# EAGLE board csa_drvio_v1.1a (EAGLE 6.4)
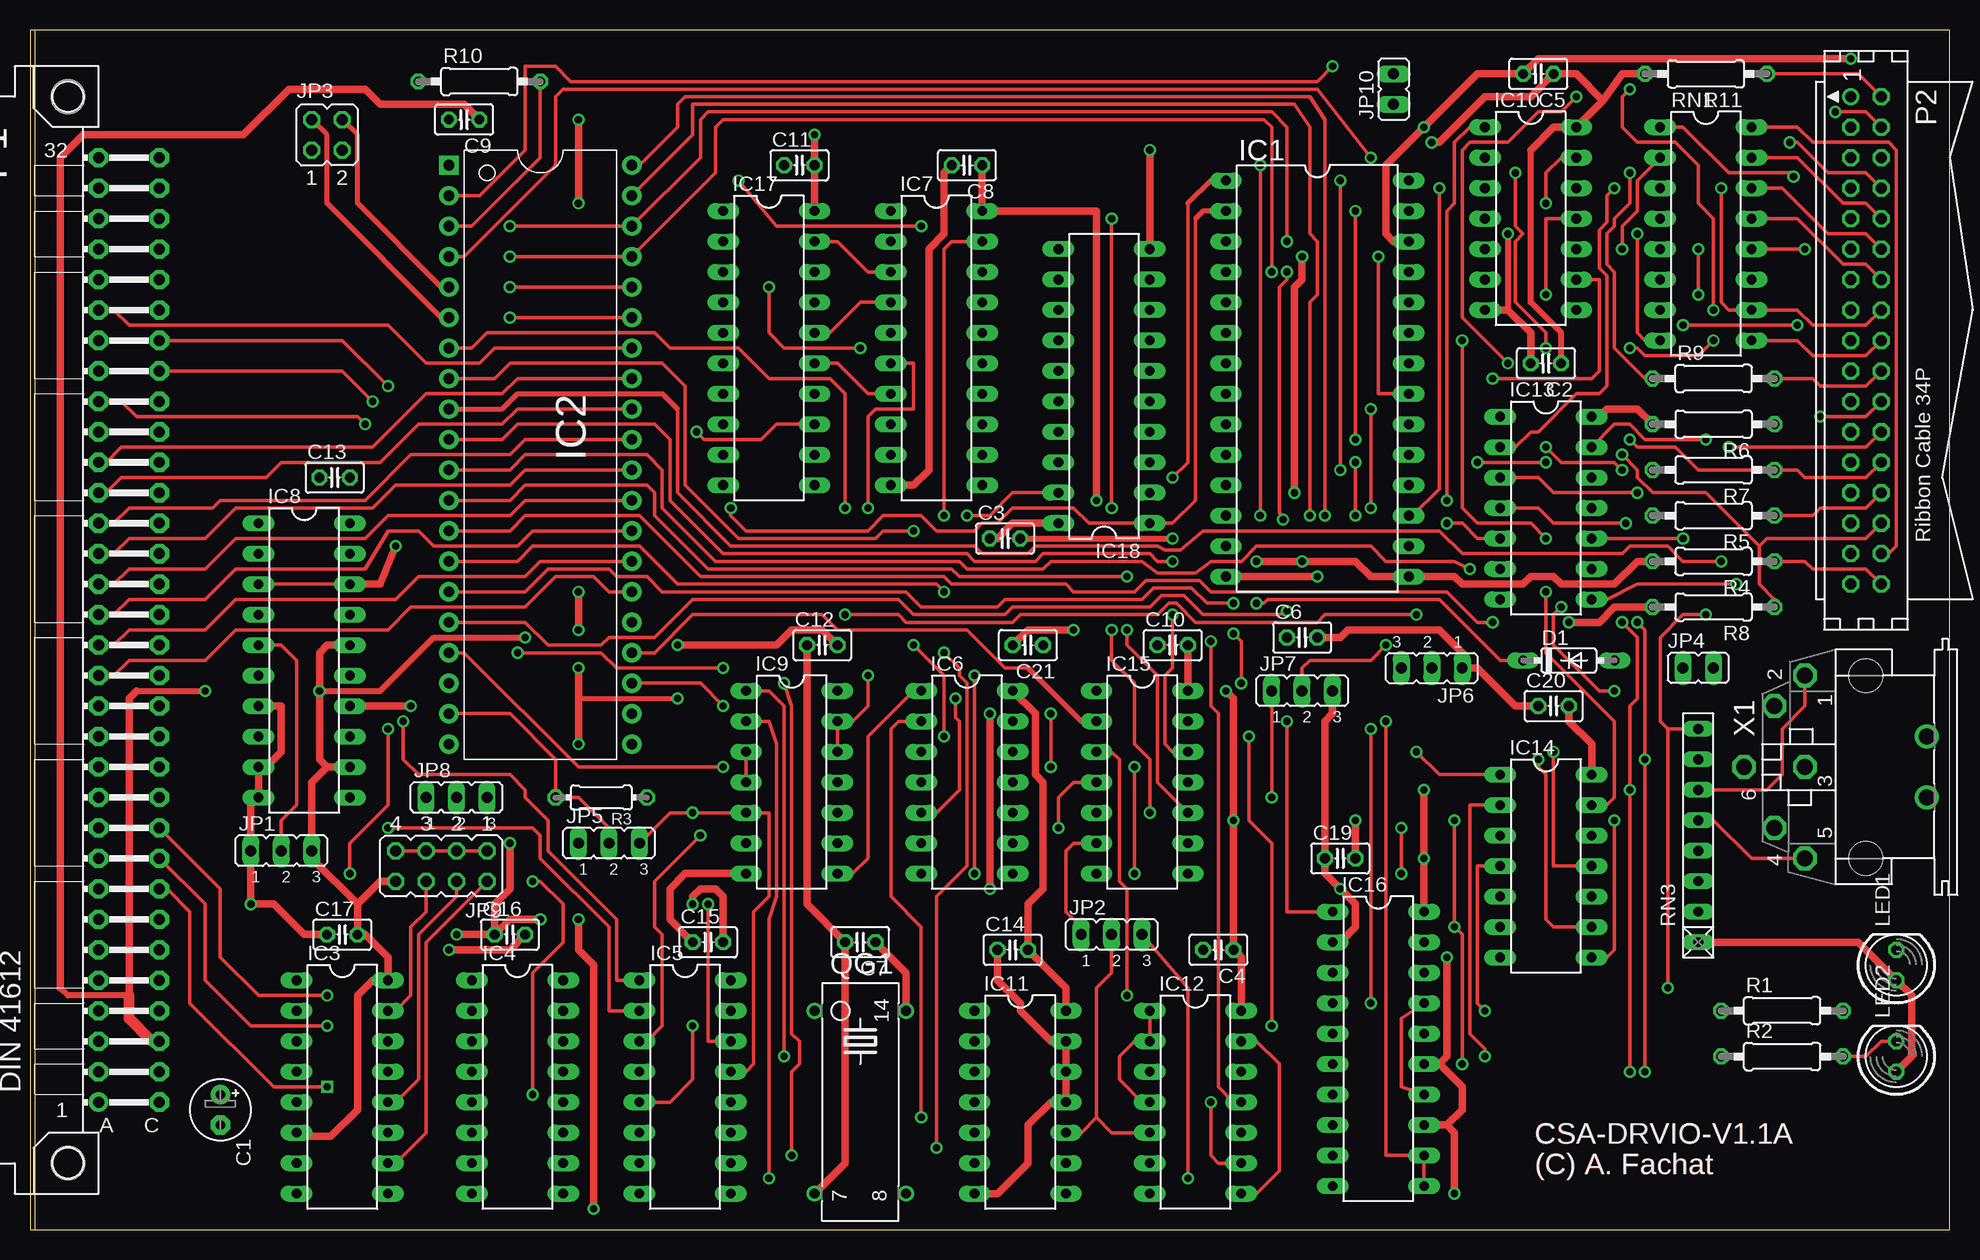
[diagram p2: board, top side]
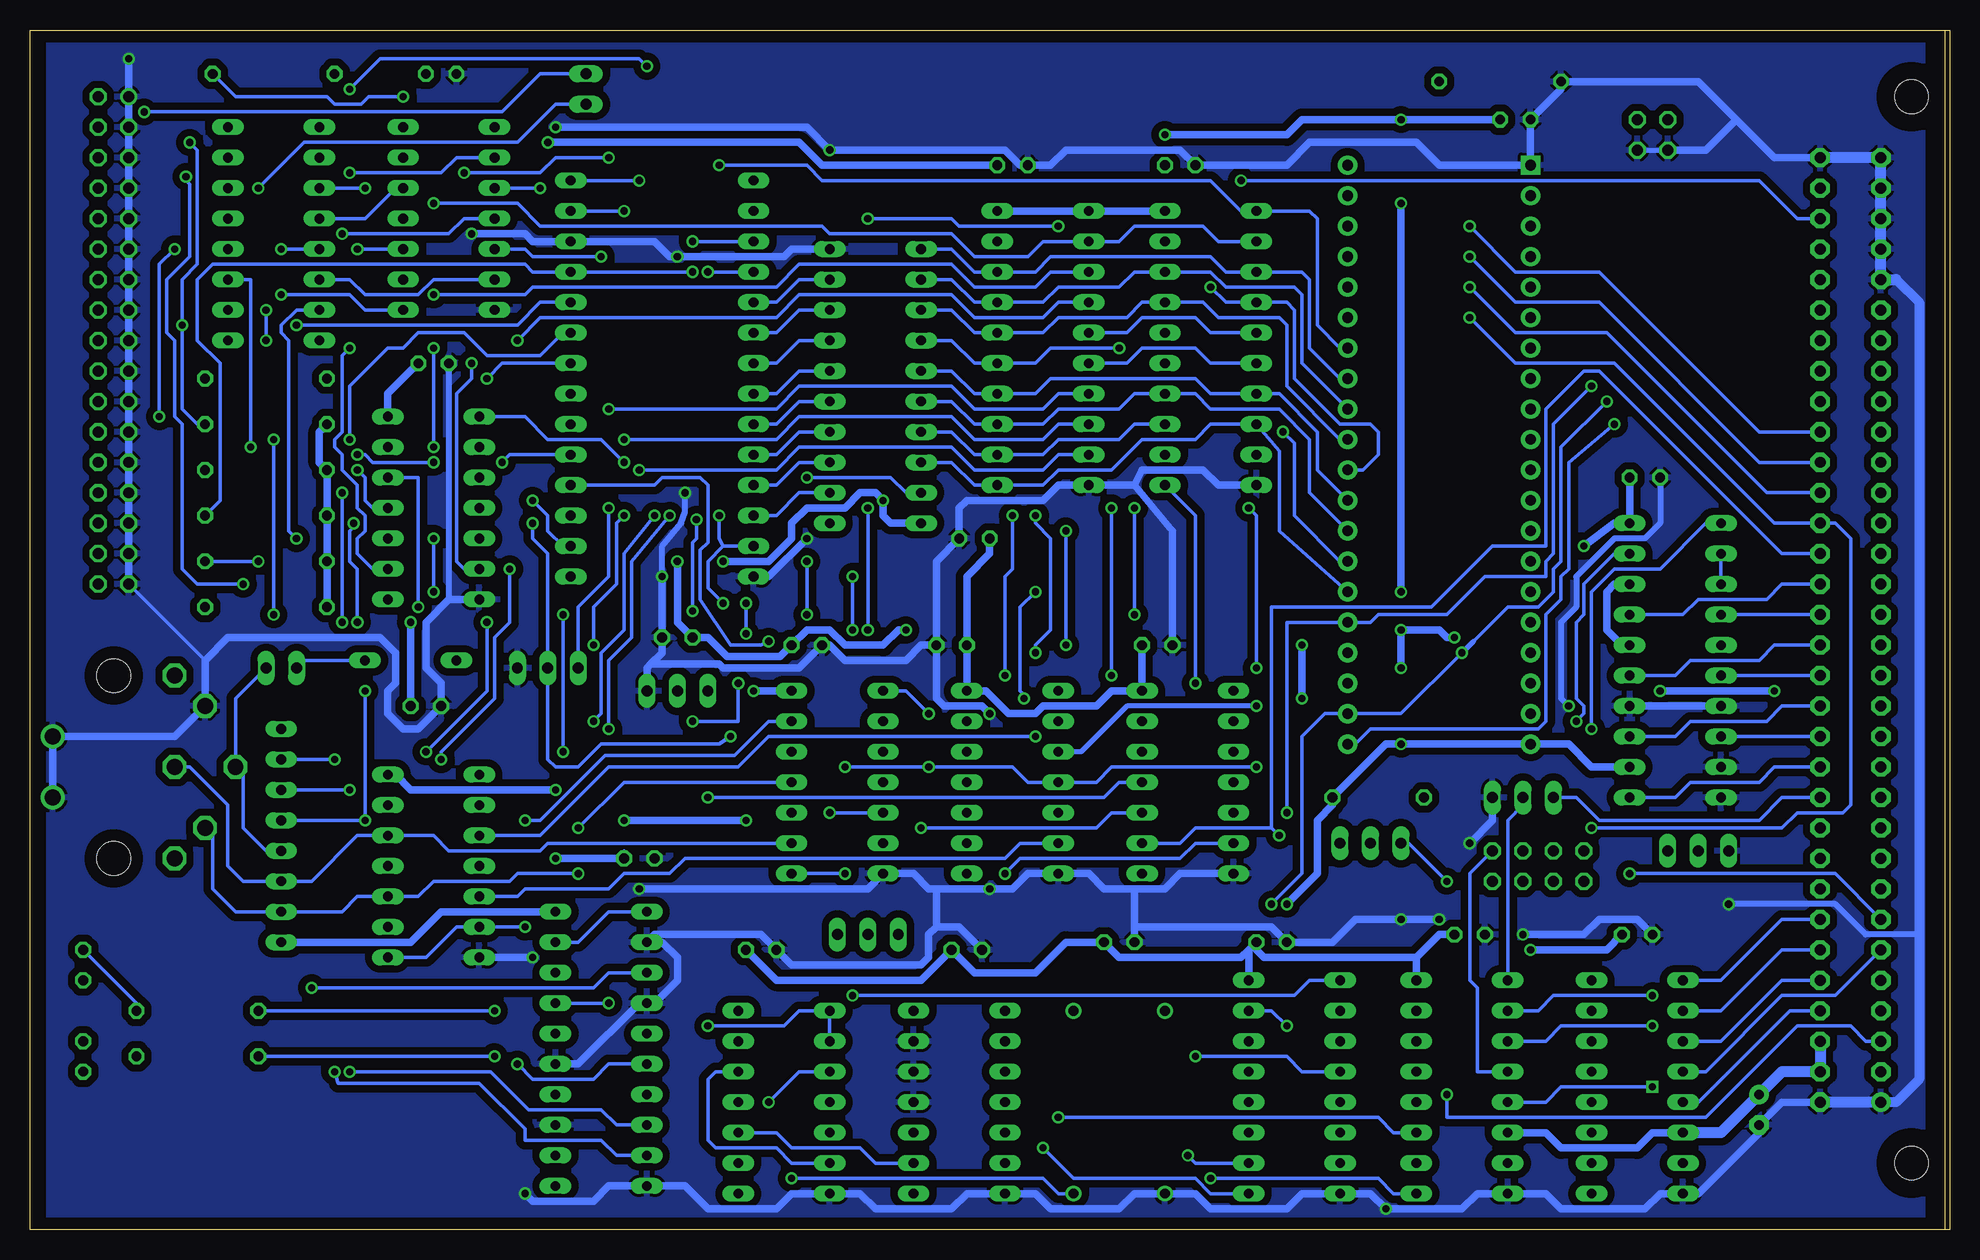
[diagram p3: board, bottom side, seen from below]

Size 160 x 100.03 mm. Coordinates in mm from the lower left corner, seen from the top.
Outline: 0,0.01 160,0.01 160,100.01 0,100.01 0,0.01
Copper layers (1*16): Top 0.035mm / dielectric 1.5mm / Bottom 0.035mm
Design rules "default *": minimum track width 10mil, minimum drill 12mil, track to track 8mil, track to pad 8mil, pad to pad 8mil, via to via 8mil, smd to smd 8mil, copper to edge 40mil, drill to drill 8mil, minimum pad ring 10mil, minimum via ring 8mil, stop-mask expansion 4mil, vias tented up to drill 0mil, thermal gap 10mil

## Footprints (pad centres in the part's own frame; a part is rotated, then mirrored left to right if it is on the bottom)
E2,5-5 = drill 0.813 pad 1.6: + -1.27,0 | drill 0.813 pad 1.6 octagon: - 1.27,0
C025-025X050 = drill 0.813 octagon: 1 -1.27,0; 2 1.27,0
DO35-7 = drill 0.813 long: A 3.81,0; C -3.81,0
DIL28 = drill 0.813 long: 1 -13.97,-7.62; 2 -11.43,-7.62; 3 -8.89,-7.62; 4 -6.35,-7.62; 5 -3.81,-7.62; 6 -1.27,-7.62; 7 1.27,-7.62; 8 3.81,-7.62; 9 6.35,-7.62; 10 8.89,-7.62; 11 11.43,-7.62; 12 13.97,-7.62; 13 16.51,-7.62; 14 19.05,-7.62; 15 19.05,7.62; 16 16.51,7.62; 17 13.97,7.62; 18 11.43,7.62; 19 8.89,7.62; 20 6.35,7.62; 21 3.81,7.62; 22 1.27,7.62; 23 -1.27,7.62; 24 -3.81,7.62; 25 -6.35,7.62; 26 -8.89,7.62; 27 -11.43,7.62; 28 -13.97,7.62
DIP40 = drill 0.889 pad 1.6 square: 1 -24.13,-7.62 | drill 0.889 pad 1.6: 2 -21.59,-7.62; 3 -19.05,-7.62; 4 -16.51,-7.62; 5 -13.97,-7.62; 6 -11.43,-7.62; 7 -8.89,-7.62; 8 -6.35,-7.62; 9 -3.81,-7.62; 10 -1.27,-7.62; 11 1.27,-7.62; 12 3.81,-7.62; 13 6.35,-7.62; 14 8.89,-7.62; 15 11.43,-7.62; 16 13.97,-7.62; 17 16.51,-7.62; 18 19.05,-7.62; 19 21.59,-7.62; 20 24.13,-7.62; 21 24.13,7.62; 22 21.59,7.62; 23 19.05,7.62; 24 16.51,7.62; 25 13.97,7.62; 26 11.43,7.62; 27 8.89,7.62; 28 6.35,7.62; 29 3.81,7.62; 30 1.27,7.62; 31 -1.27,7.62; 32 -3.81,7.62; 33 -6.35,7.62; 34 -8.89,7.62; 35 -11.43,7.62; 36 -13.97,7.62; 37 -16.51,7.62; 38 -19.05,7.62; 39 -21.59,7.62; 40 -24.13,7.62
DIL16 = drill 0.813 long: 1 -8.89,-3.81; 2 -6.35,-3.81; 3 -3.81,-3.81; 4 -1.27,-3.81; 5 1.27,-3.81; 6 3.81,-3.81; 7 6.35,-3.81; 8 8.89,-3.81; 9 8.89,3.81; 10 6.35,3.81; 11 3.81,3.81; 12 1.27,3.81; 13 -1.27,3.81; 14 -3.81,3.81; 15 -6.35,3.81; 16 -8.89,3.81
DIL14 = drill 0.813 long: 1 -7.62,-3.81; 2 -5.08,-3.81; 3 -2.54,-3.81; 4 0,-3.81; 5 2.54,-3.81; 6 5.08,-3.81; 7 7.62,-3.81; 8 7.62,3.81; 9 5.08,3.81; 10 2.54,3.81; 11 0,3.81; 12 -2.54,3.81; 13 -5.08,3.81; 14 -7.62,3.81
DIL20 = drill 0.813 long: 1 -11.43,-3.81; 2 -8.89,-3.81; 3 -6.35,-3.81; 4 -3.81,-3.81; 5 -1.27,-3.81; 6 1.27,-3.81; 7 3.81,-3.81; 8 6.35,-3.81; 9 8.89,-3.81; 10 11.43,-3.81; 11 11.43,3.81; 12 8.89,3.81; 13 6.35,3.81; 14 3.81,3.81; 15 1.27,3.81; 16 -1.27,3.81; 17 -3.81,3.81; 18 -6.35,3.81; 19 -8.89,3.81; 20 -11.43,3.81
DIL20' = drill 0.813 long: 1 -10.16,-3.81; 2 -7.62,-3.81; 3 -5.08,-3.81; 4 -2.54,-3.81; 5 0,-3.81; 6 2.54,-3.81; 7 5.08,-3.81; 8 7.62,-3.81; 9 10.16,-3.81; 10 12.7,-3.81; 11 12.7,3.81; 12 10.16,3.81; 13 7.62,3.81; 14 5.08,3.81; 15 2.54,3.81; 16 0,3.81; 17 -2.54,3.81; 18 -5.08,3.81; 19 -7.62,3.81; 20 -10.16,3.81
JP2 = drill 0.914 long: 1 -2.54,0; 2 0,0; 3 2.54,0
JP2Q = drill 0.914 octagon: 1 -1.27,-1.27; 2 -1.27,1.27; 3 1.27,-1.27; 4 1.27,1.27
JP1 = drill 0.914 long: 1 0,-1.27; 2 0,1.27
JP4Q = drill 0.914 octagon: 1 -3.81,-1.27; 2 -3.81,1.27; 3 -1.27,-1.27; 4 -1.27,1.27; 5 1.27,-1.27; 6 1.27,1.27; 7 3.81,-1.27; 8 3.81,1.27
LED5MM = drill 0.813 octagon: A -1.27,0; K 1.27,0
CSABUS = drill 0.914 pad 1.6: A1 7.62,36.83 | drill 0.914 pad 1.6 octagon: A2 7.62,34.29; A3 7.62,31.75; A4 7.62,29.21; A5 7.62,26.67; A6 7.62,24.13; A7 7.62,21.59; A8 7.62,19.05; A9 7.62,16.51; A10 7.62,13.97; A11 7.62,11.43; A12 7.62,8.89; A13 7.62,6.35; A14 7.62,3.81; A15 7.62,1.27; A16 7.62,-1.27; A17 7.62,-3.81; A18 7.62,-6.35; A19 7.62,-8.89; A20 7.62,-11.43; A21 7.62,-13.97; A22 7.62,-16.51; A23 7.62,-19.05; A24 7.62,-21.59; A25 7.62,-24.13; A26 7.62,-26.67; A27 7.62,-29.21; A28 7.62,-31.75; A29 7.62,-34.29; A30 7.62,-36.83; A31 7.62,-39.37; A32 7.62,-41.91; C1 2.54,36.83; C2 2.54,34.29; C3 2.54,31.75; C4 2.54,29.21; C5 2.54,26.67; C6 2.54,24.13; C7 2.54,21.59; C8 2.54,19.05; C9 2.54,16.51; C10 2.54,13.97; C11 2.54,11.43; C12 2.54,8.89; C13 2.54,6.35; C14 2.54,3.81; C15 2.54,1.27; C16 2.54,-1.27; C17 2.54,-3.81; C18 2.54,-6.35; C19 2.54,-8.89; C20 2.54,-11.43; C21 2.54,-13.97; C22 2.54,-16.51; C23 2.54,-19.05; C24 2.54,-21.59; C25 2.54,-24.13; C26 2.54,-26.67; C27 2.54,-29.21; C28 2.54,-31.75; C29 2.54,-34.29; C30 2.54,-36.83; C31 2.54,-39.37; C32 2.54,-41.91 | hole 2.794: 10.16,41.91; 10.16,-46.99
CON34 = drill 0.914: 1 -19.05,-1.27 | drill 0.914 octagon: 2 -19.05,1.27; 3 -16.51,-1.27; 4 -16.51,1.27; 5 -13.97,-1.27; 6 -13.97,1.27; 7 -11.43,-1.27; 8 -11.43,1.27; 9 -8.89,-1.27; 10 -8.89,1.27; 11 -6.35,-1.27; 12 -6.35,1.27; 13 -3.81,-1.27; 14 -3.81,1.27; 15 -1.27,-1.27; 16 -1.27,1.27; 17 1.27,-1.27; 18 1.27,1.27; 19 3.81,-1.27; 20 3.81,1.27; 21 6.35,-1.27; 22 6.35,1.27; 23 8.89,-1.27; 24 8.89,1.27; 25 11.43,-1.27; 26 11.43,1.27; 27 13.97,-1.27; 28 13.97,1.27; 29 16.51,-1.27; 30 16.51,1.27; 31 19.05,-1.27; 32 19.05,1.27; 33 21.59,-1.27; 34 21.59,1.27
SG51 = drill 0.813: 1 -7.62,-3.81; 7 7.62,-3.81; 8 7.62,3.81; 14 -7.62,3.81
0207/10 = drill 0.813 octagon: 1 -5.08,0; 2 5.08,0
0204/7 = drill 0.813 octagon: 1 -3.81,0; 2 3.81,0
RN-8 = drill 0.813 long: 1 -8.89,0; 2 -6.35,0; 3 -3.81,0; 4 -1.27,0; 5 1.27,0; 6 3.81,0; 7 6.35,0; 8 8.89,0
MAB6H = drill 1.321 octagon: 1 7.62,5.08; 2 5.08,7.62; 3 0,5.08; 4 -5.08,7.62; 5 -7.62,5.08; 6 0,10.16 | drill 1.321: PE -2.54,-5.08; PE@ 2.54,-5.08 | hole 2.794: 7.62,0; -7.62,0

## Placement (x,y rotation side)
C1  47u  [E2,5-5]  15.87,10.01 270 top
C2  [C025-025X050]  126.36,72.24 180 top
C3  [C025-025X050]  81.27,57.63 0 top
C4  [C025-025X050]  99.05,23.34 180 top
C5  [C025-025X050]  125.72,96.37 180 top
C6  [C025-025X050]  106.04,49.38 0 top
C7  [C025-025X050]  69.21,23.98 180 top
C8  [C025-025X050]  78.1,88.75 180 top
C9  [C025-025X050]  36.19,92.56 180 top
C10  [C025-025X050]  95.24,48.74 0 top
C11  [C025-025X050]  64.13,88.75 0 top
C12  [C025-025X050]  66.03,48.74 0 top
C13  [C025-025X050]  25.39,62.71 0 top
C14  [C025-025X050]  81.91,23.34 0 top
C15  [C025-025X050]  56.51,23.98 0 top
C16  [C025-025X050]  40,24.61 0 top
C17  [C025-025X050]  26.03,24.61 0 top
C19  [C025-025X050]  109.21,30.96 0 top
C20  [C025-025X050]  126.99,43.66 0 top
C21  [C025-025X050]  83.18,48.74 180 top
D1  1N4148DO35-7  [DO35-7]  128.27,47.47 0 top
IC1  WD1770  [DIL28]  107.31,73.51 270 top
IC2  CIASMALLPADS  [DIP40]  42.54,64.62 270 top
IC3  74HCT138N  [DIL16]  26.03,11.91 270 top
IC4  74HCT138N  [DIL16]  40.64,11.91 270 top
IC5  74HCT139N  [DIL16]  54.61,11.91 270 top
IC6  74HCT08N  [DIL14]  78.1,37.31 270 top
IC7  74HCT245N  [DIL20]  75.56,73.51 270 top
IC8  74LS688BUSOPT  [DIL20']  22.86,48.74 270 top
IC9  74HCT00N  [DIL14]  63.5,37.31 270 top
IC10  74LS06N  [DIL14]  125.09,84.3 270 top
IC11  74LS293N  [DIL14]  82.55,10.64 270 top
IC12  74HCT00N  [DIL14]  97.15,10.64 270 top
IC13  74LS07N  [DIL14]  126.36,60.17 270 top
IC14  74LS06N  [DIL14]  126.36,30.33 270 top
IC15  74HC14N  [DIL14]  92.7,37.31 270 top
IC16  74HCT241N  [DIL20]  112.39,15.09 270 top
IC17  74LS273BUSOPT  [DIL20']  61.59,74.78 270 top
IC18  74HCT245N  [DIL20]  89.53,70.33 90 top
JP1  [JP2]  20.95,31.6 0 top
JP2  [JP2]  90.16,24.61 0 top
JP3  [JP2Q]  24.76,91.29 0 top
JP4  [JP1]  139.06,46.84 270 top
JP5  [JP2]  48.26,32.23 0 top
JP6  [JP2]  116.83,46.84 180 top
JP7  [JP2]  106.04,44.93 0 top
JP8  [JP2]  35.55,36.04 0 top
JP9  [JP4Q]  34.29,30.33 180 top
JP10  [JP1]  113.66,95.1 0 top
LED1  [LED5MM]  155.57,22.07 90 top
LED2  [LED5MM]  155.57,14.45 90 top
P1  CSABUS  [CSABUS]  13.33,47.47 180 top
P2  SHUGART  [CON34]  153.03,75.41 270 top
QG1  16MHz  [SG51]  69.21,10.64 270 top
R1  150  [0207/10]  146.04,18.26 0 top
R2  620  [0207/10]  146.04,14.45 0 top
R3  4k7  [0204/7]  47.62,36.04 180 top
R4  1k  [0207/10]  140.33,55.73 180 top
R5  1k  [0207/10]  140.33,59.54 180 top
R6  1k  [0207/10]  140.33,67.16 180 top
R7  1k  [0207/10]  140.33,63.35 180 top
R8  220  [0207/10]  140.33,51.92 180 top
R9  47  [0207/10]  140.33,70.97 0 top
R10  4k7  [0207/10]  37.46,95.73 0 top
R11  4k7  [0207/10]  139.69,96.37 180 top
RN1  47  [DIL16]  139.69,83.03 270 top
RN3  10k  [RN-8]  139.06,32.87 90 top
X1  MAB6H  [MAB6H]  153.03,38.58 90 top

## Tracks (layer width: path | path; a pad name or v marks a point on that pad's centre or on a via)
16MHZ  (via drill 0.6)
  Top 0.305: v59.05,87.48 62.23,83.67 v74.29,83.67 | v90.16,84.3 v90.16,60.17 | v90.16,50.01 90.16,47.47 92.07,45.57 92.07,40.49 93.34,39.22 v93.34,34.77
  Bottom 0.305: P1.C30 12.7,84.3 15.87,87.48 v59.05,87.48 | v74.29,83.67 82.55,83.67 83.18,84.3 v90.16,84.3 | v90.16,60.17 v90.16,50.01 | v93.34,34.77 IC15.5
50HZ  (via drill 0.6)
  Top 0.305: v41.91,29.06 42.54,29.06 44.45,27.15 44.45,23.98 41.91,21.44 v41.91,11.28
  Bottom 0.305: P1.A3 6.98,15.72 8.25,16.99 12.7,16.99 20.31,9.37 41.91,9.37 v41.91,11.28 | JP5.1 45.08,32.23 v41.91,29.06
/CIA  (via drill 0.6)
  Top 0.305: v74.29,9.37 74.29,25.25 71.75,27.79 71.75,41.76 72.38,42.39 IC6.2
  Bottom 0.305: IC4.11 46.35,8.1 47.62,9.37 v74.29,9.37
/CIASEL  (via drill 0.6)
  Top 0.305: IC2.23 55.88,45.57 v57.78,43.66
  Bottom 0.406: v57.78,43.66 68.57,43.66 72.38,39.85 IC6.3
/IOSEL  (via drill 0.6)
  Top 0.305: v29.84,41.76 29.84,35.41 26.66,32.23 v26.66,29.69
  Bottom 0.305: IC8.1 20.31,58.9 24.12,55.09 27.93,55.09 29.84,53.19 v29.84,41.76 | v26.66,29.69 9.52,29.69 P1.A7
/IRQ  (via drill 0.6)
  Top 0.305: P1.A24 7.62,69.06 8.89,67.79 27.3,67.79 v27.93,67.16
  Bottom 0.305: v27.93,67.16 31.74,63.98 31.74,55.09 32.38,54.46 32.38,52.55 33.65,51.28 33.65,42.39 34.29,41.76 48.26,41.76 49.53,40.49 IC2.21
/MEMSEL
  Bottom 0.305: P1.A6 9.52,19.53 13.97,19.53 20.31,13.18 IC3.4
/RCTRL  (via drill 0.6)
  Top 0.305: v75.56,6.83 75.56,27.79 78.1,30.33 78.1,45.57 77.46,46.2 77.46,46.84 v76.19,48.11 | v76.19,59.54 76.19,81.76 76.83,82.4 IC7.19
  Bottom 0.305: IC5.9 61.59,3.02 62.86,4.29 73.02,4.29 v75.56,6.83 | v76.19,48.11 76.19,48.74 74.92,50.01 74.92,57.63 76.19,58.9 v76.19,59.54
/RES  (via drill 0.6)
  Top 0.305: P1.A27 6.98,76.68 8.25,75.41 29.84,75.41 33.02,72.24 37.46,72.24 38.73,73.51 IC2.34 | v102.55,88.75 v102.55,59.54 | D1.C 122.55,47.47 117.47,52.55 103.18,52.55 102.86,52.23 v102.23,52.23
  Bottom 0.305: IC2.34 50.8,73.51 52.7,75.41 52.7,84.3 53.34,84.94 IC17.1 59.05,84.94 61.59,87.48 93.97,87.48 95.24,88.75 v102.55,88.75 | v102.23,52.23 103.5,53.51 103.5,55.73 102.23,57 | 102.23,57 IC1.13 | v102.55,59.54 102.55,57.63 102.23,57
/WCTRL  (via drill 0.6)
  Top 0.305: v63.5,6.2 63.5,13.18 64.13,13.82 64.13,15.72 63.5,16.36 63.5,43.66 v62.86,45.57
  Bottom 0.305: IC5.10 62.86,5.56 v63.5,6.2 | v62.86,45.57 62.86,59.54 IC17.11
/WDC  (via drill 0.6)
  Top 0.305: v61.59,4.29 61.59,25.88 62.23,27.79 62.23,40.49 61.59,42.39 IC9.2
  Bottom 0.305: IC4.9 46.35,3.02 47.62,4.29 v61.59,4.29
A0  (via drill 0.6)
  Top 0.305: v40,83.67 IC2.38 55.88,89.38 55.88,92.56 56.51,93.19 103.5,93.19 104.77,91.92 v104.77,82.4
  Bottom 0.305: P1.C23 15.87,66.52 29.2,79.86 36.19,79.86 v40,83.67 | v104.77,82.4 IC1.3
A1  (via drill 0.6)
  Top 0.305: v40,81.13 IC2.37 57.15,88.11 57.15,91.92 57.78,92.56 102.86,92.56 103.5,91.92 v103.5,79.86
  Bottom 0.305: P1.C22 15.87,63.98 29.2,77.32 36.19,77.32 v40,81.13 | v103.5,79.86 IC1.4
A2  (via drill 0.6)
  Top 0.305: v40,78.59 IC2.36
  Bottom 0.305: P1.C21 15.24,61.44 28.57,74.78 36.19,74.78 v40,78.59
A3  (via drill 0.6)
  Top 0.305: v40,76.05 IC2.35 | v29.84,33.5 41.91,33.5 42.54,32.87 42.54,30.96 48.26,25.25 48.26,18.26 IC5.2
  Bottom 0.305: v40,76.05 36.19,72.24 27.93,72.24 14.6,58.9 P1.C20 9.52,58.9 8.25,57.63 8.25,35.41 8.89,34.77 12.7,34.77 13.97,33.5 v29.84,33.5
A4  (via drill 0.6)
  Top 0.305: IC5.3 51.43,15.72 52.7,16.99 52.7,24.61 52.07,25.25 52.07,29.06 v55.88,32.87
  Bottom 0.305: P1.C19 13.97,56.36 29.2,71.6 30.47,71.6 33.65,68.43 33.65,57 38.1,57 43.18,51.92 56.51,51.92 56.51,33.5 | 56.51,33.5 62.86,33.5 64.13,32.23 IC9.9 | v55.88,32.87 56.51,33.5
A5
  Bottom 0.305: P1.C18 13.97,53.82 15.24,52.55 20.95,52.55 22.22,51.28 IC8.17
A6
  Bottom 0.305: P1.C17 IC8.4
A7
  Bottom 0.305: P1.C16 14.6,48.74 15.87,47.47 21.58,47.47 22.86,46.2 IC8.15
A8
  Bottom 0.305: P1.C15 IC8.6
A9
  Bottom 0.305: P1.C14 13.97,43.66 15.24,42.39 21.58,42.39 22.86,41.12 IC8.13
A10
  Bottom 0.305: P1.C13 IC8.8
A11
  Bottom 0.305: P1.C12 14.6,38.58 15.87,37.31 21.58,37.31 22.86,36.04 IC8.11
A12
  Bottom 0.305: P1.C11 13.97,36.04 15.87,34.14 29.2,34.14 31.11,36.04 JP8.1
A13  (via drill 0.6)
  Top 0.305: P1.C10 15.87,28.42 15.87,22.71 19.04,19.53 v24.76,19.53
  Bottom 0.305: v24.76,19.53 33.02,19.53 34.29,18.26 IC4.2
A14  (via drill 0.6)
  Top 0.305: P1.C9 14.6,27.15 14.6,20.8 18.41,16.99 v24.76,16.99
  Bottom 0.305: v24.76,16.99 32.38,16.99 33.65,15.72 IC4.3
A15  (via drill 0.6)
  Top 0.305: P1.C8 11.43,28.42 13.33,26.52 13.33,18.9 20.31,11.91 v24.76,11.91
  Bottom 0.305: v24.76,11.91 32.38,11.91 33.65,10.64 IC4.5
A16
  Bottom 0.305: P1.C7 13.97,25.88 19.04,20.8 IC3.1
A17
  Bottom 0.305: P1.C6 13.97,23.34 19.04,18.26 IC3.2
A18
  Bottom 0.305: P1.C5 13.97,20.8 19.04,15.72 IC3.3
A19
  Bottom 0.305: P1.C4 13.33,18.26 20.95,10.64 IC3.5
ACTLED  (via drill 0.6)
  Top 0.305: IC2.8 38.73,70.97 40,72.24 52.7,72.24 54.61,70.33 54.61,62.08 59.05,57.63 70.48,57.63 71.11,58.27 v73.66,58.27 | v73.66,48.74 76.19,46.2 v76.19,41.12
  Bottom 0.305: v73.66,58.27 v73.66,48.74 | v76.19,41.12 98.42,41.12 100.96,38.58 111.75,38.58 117.47,32.87 IC14.3
ATN
  Bottom 0.305: IC15.9 116.83,32.23 117.47,31.6 125.09,31.6 126.36,32.87 IC14.12 132.71,32.87 136.52,29.06 RN3.3 142.23,29.06 143.5,30.33 143.5,35.41 146.68,38.58 X1.3
ATNA  (via drill 0.6)
  Top 0.305: IC2.14 40.64,55.73 41.91,57 50.8,57 53.97,53.82 75.56,53.82 v76.19,53.19 | v77.15,44.3 77.15,42.71 77.46,42.39 77.46,36.68 75.56,34.77 IC6.5
  Bottom 0.305: v76.19,53.19 77.46,51.92 77.46,44.93 77.15,44.62 v77.15,44.3
ATNIN  (via drill 0.6)
  Top 0.305: IC2.17 36.19,48.11 45.72,38.58 v57.78,38.58 | v85.08,38.58 v85.08,43.03 | v92.07,38.58 v92.07,29.69
  Bottom 0.305: v57.78,38.58 69.84,38.58 71.11,37.31 IC6.4 76.83,37.31 78.1,38.58 v85.08,38.58 v92.07,38.58 | v85.08,43.03 86.99,44.93 IC15.1 | v92.07,29.69 IC15.8
ATNOUT  (via drill 0.6)
  Top 0.305: IC17.16 66.67,74.78 69.21,77.32 IC7.4 | IC14.13 131.44,35.41 132.07,36.04 132.07,42.39 126.36,48.11 v126.36,53.19 | v119.38,74.14 119.38,60.17 120.64,58.9 125.09,58.9 v126.36,57.63
  Bottom 0.305: IC7.4 74.29,77.32 75.56,76.05 81.27,76.05 83.18,77.95 95.88,77.95 97.78,76.05 117.47,76.05 v119.38,74.14 | v126.36,57.63 v126.36,53.19
CLKIN  (via drill 0.6)
  Top 0.305: IC2.12 40,60.81 41.27,62.08 51.43,62.08 52.07,61.44 52.07,59.54 56.51,55.09 76.83,55.09 77.46,54.46 v91.44,54.46 | IC15.10 93.97,37.31 93.97,46.2 91.44,48.74 v91.44,50.01
  Bottom 0.305: v91.44,50.01 v91.44,54.46
CLKOUT  (via drill 0.6)
  Top 0.305: IC2.13 40,58.27 41.27,59.54 50.8,59.54 55.88,54.46 76.19,54.46 76.83,53.82 86.35,53.82 86.99,53.19 92.07,53.19 93.02,54.14 97.47,54.14 98.42,53.19 118.1,53.19 120.64,50.65 v121.91,50.65 | v126.99,39.85 126.99,30.33 IC14.11
  Bottom 0.305: v121.91,50.65 121.91,44.93 v126.99,39.85
D0
  Top 0.305: P1.A22 6.34,63.98 7.62,65.25 28.57,65.25 33.02,69.7 39.37,69.7 40.64,70.97 IC2.33
  Bottom 0.305: IC2.33 50.8,70.97 53.34,73.51 53.34,79.22 53.97,79.86 IC17.3 60.32,79.86 61.59,81.13 74.92,81.13 76.19,79.86 IC7.18 81.27,79.86 83.18,81.76 IC18.11
D1
  Top 0.305: P1.A21 6.34,61.44 7.62,62.71 19.68,62.71 20.95,63.98 29.2,63.98 32.38,67.16 39.37,67.16 40.64,68.43 IC2.32
  Bottom 0.305: IC2.32 53.97,72.24 53.97,77.95 54.61,78.59 60.32,78.59 61.59,79.86 IC17.18 67.94,79.86 69.21,78.59 74.29,78.59 75.56,77.32 IC7.17 81.27,77.32 83.18,79.22 IC18.12
D2
  Top 0.305: P1.A20 6.98,58.9 8.25,60.17 15.24,60.17 15.87,60.81 27.93,60.81 31.74,64.62 40,64.62 41.27,65.89 IC2.31
  Bottom 0.305: IC2.31 50.8,65.89 55.24,70.33 55.24,75.41 55.88,76.05 60.96,76.05 62.23,77.32 IC17.17 67.3,77.32 68.57,76.05 74.29,76.05 75.56,74.78 IC7.16 81.27,74.78 83.18,76.68 IC18.13
D3  (via drill 0.6)
  Top 0.305: P1.A19 6.98,56.36 8.25,57.63 14.6,57.63 17.14,60.17 28.57,60.17 30.47,62.08 40,62.08 41.27,63.35 IC2.30 | v61.59,78.59 61.59,74.78 62.86,73.51 v69.21,73.51
  Bottom 0.305: IC2.30 48.89,63.35 47.62,64.62 47.62,66.52 48.26,67.16 50.8,67.16 54.61,70.97 54.61,76.68 55.24,77.32 IC17.4 60.32,77.32 v61.59,78.59 | IC18.14 83.18,74.14 81.27,72.24 IC7.15 76.19,72.24 74.92,73.51 v69.21,73.51
D4
  Top 0.305: P1.A18 6.98,53.82 8.25,55.09 14.6,55.09 17.14,57.63 27.93,57.63 29.84,59.54 40,59.54 41.27,60.81 IC2.29
  Bottom 0.305: IC2.29 52.7,63.35 52.7,66.52 55.88,69.7 IC17.7 61.59,69.7 62.86,70.97 74.92,70.97 76.19,69.7 IC7.14 81.27,69.7 83.18,71.6 IC18.15
D5
  Top 0.305: P1.A17 6.98,51.28 8.25,52.55 14.6,52.55 17.14,55.09 27.93,55.09 29.84,58.27 32.38,58.27 33.65,57 40.64,57 41.91,58.27 IC2.28
  Bottom 0.305: IC2.28 53.34,61.44 53.34,65.89 55.88,68.43 61.59,68.43 62.86,69.7 IC17.14 67.94,69.7 69.21,68.43 74.29,68.43 75.56,67.16 IC7.13 81.27,67.16 83.18,69.06 IC18.16
D6  (via drill 0.6)
  Top 0.305: P1.A16 6.98,48.74 8.25,50.01 14.6,50.01 17.14,52.55 30.47,52.55 32.38,54.46 41.27,54.46 42.54,55.73 IC2.27 | v55.56,66.52 56.19,65.89 60.96,65.89 62.23,67.16 IC17.13
  Bottom 0.305: IC17.13 67.94,67.16 69.21,65.89 74.29,65.89 75.56,64.62 IC7.12 81.27,64.62 83.18,66.52 IC18.17 | IC2.27 50.8,55.73 54.61,59.54 54.61,65.57 v55.56,66.52
D7
  Top 0.305: P1.A15 6.98,46.2 8.25,47.47 14.6,47.47 17.14,50.01 29.84,50.01 31.74,51.92 41.27,51.92 43.81,54.46 46.98,54.46 48.26,53.19 IC2.26
  Bottom 0.305: IC18.18 83.18,63.98 81.27,62.08 IC7.11 75.56,62.08 74.29,63.35 69.84,63.35 67.3,65.89 62.86,65.89 61.59,67.16 IC17.8 55.88,64.94 55.88,58.27 IC2.26
DATA  (via drill 0.6)
  Top 0.305: v118.74,34.14 v118.74,25.25 119.38,24.61 v119.38,13.82 | RN3.5 140.33,34.14 143.5,30.96 X1.5 | IC14.8 131.44,22.71 132.07,23.34 v132.07,34.14 | v132.07,44.93 130.81,44.93 126.99,48.74 126.99,51.28 v127.63,51.92
  Bottom 0.305: IC15.13 98.42,42.39 101.28,39.54 112.07,39.54 117.47,34.14 v118.74,34.14 | v118.74,25.25 IC14.6 124.45,25.25 126.99,22.71 IC14.8 | IC16.6 111.75,13.82 113.02,12.55 118.1,12.55 v119.38,13.82 | RN3.5 v132.07,34.14 v132.07,44.93 | v127.63,51.92 127.63,62.71 IC13.12
DATAIN  (via drill 0.6)
  Top 0.305: IC2.10 39.37,65.89 40.64,67.16 52.07,67.16 53.34,65.89 53.34,60.81 57.78,56.36 78.1,56.36 78.73,55.73 83.81,55.73 84.45,56.36 93.34,56.36 93.97,55.73 v95.24,55.73 | IC15.12 95.24,39.85 94.61,40.49 94.61,46.2 95.24,46.84 v95.24,51.28
  Bottom 0.305: v95.24,51.28 v95.24,55.73
DATAOUT  (via drill 0.6)
  Top 0.305: IC2.11 40,63.35 41.27,64.62 51.43,64.62 52.7,63.35 52.7,60.17 57.15,55.73 77.46,55.73 78.1,55.09 84.45,55.09 85.08,55.73 92.7,55.73 93.97,54.77 97.15,54.77 98.42,55.73 100.96,55.73 102.23,57 111.75,57 113.02,55.73 118.74,55.73 v120.01,55.09 | v125.72,39.22 125.72,38.58 126.36,37.95 126.36,25.88 126.99,25.25 IC14.9
  Bottom 0.305: v120.01,55.09 120.01,50.65 121.28,49.38 121.28,44.3 125.72,39.85 v125.72,39.22
DDSKCHG  (via drill 0.6)
  Top 0.305: P2.34 153.03,55.09 148.59,55.09 147.95,55.73 R4.1 | 53.97,68.43 53.97,61.44 58.41,57 78.73,57 79.37,56.36 83.18,56.36 83.81,57 93.97,57 94.61,56.68 95.88,56.68 97.78,58.27 117.47,58.27 119.38,56.36 132.71,56.36 133.34,57 136.52,57 137.79,55.73 v140.97,55.73
  Top 0.406: IC2.9 39.37,68.43 40.64,69.7 52.7,69.7 53.97,68.43
  Bottom 0.305: v140.97,55.73 R4.1
DINDEX  (via drill 0.6)
  Top 0.305: v146.68,90.65 147.31,90.65 149.85,88.11 153.03,88.11 P2.8 | v137.79,75.41 v147.31,75.41
  Bottom 0.305: R6.1 146.04,67.16 147.31,68.43 v147.31,75.41 147.31,79.22 146.04,80.49 146.04,90.02 v146.68,90.65 | IC1.24 117.47,77.32 119.38,75.41 v137.79,75.41
DIR  (via drill 0.6)
  Top 0.305: IC1.17 115.25,59.54 117.47,61.76 v117.47,86.84
  Bottom 0.305: v117.47,86.84 IC10.3
DMTRA  (via drill 0.6)
  Top 0.305: v137.79,57.63 IC13.10
  Bottom 0.305: RN1.7 137.79,76.68 139.06,75.41 139.06,74.78 138.42,74.14 138.42,58.27 v137.79,57.63
DMTRB  (via drill 0.6)
  Top 0.305: v132.71,81.76 132.71,83.67 133.98,84.94 133.98,87.48 RN1.2
  Bottom 0.305: IC10.10 v132.71,81.76
DRDDATA  (via drill 0.6)
  Top 0.305: R8.1 145.41,52.55 144.14,53.82 144.14,57 | 144.14,57 144.78,57.63 153.03,57.63 P2.30 | v120.64,63.98 v126.36,63.98 | v132.71,64.62 133.98,63.35 133.98,62.71 135.25,61.44 139.69,61.44 144.14,57
  Bottom 0.305: IC1.19 120.01,64.62 v120.64,63.98 | v126.36,63.98 131.44,63.98 132.07,64.62 v132.71,64.62
DRDY
  Top 0.305: R10.2 42.54,89.38 36.83,83.67 IC2.3
DSELA  (via drill 0.6)
  Top 0.305: JP7.2 106.04,46.84 106.67,47.47 111.75,47.47 v113.02,48.74 | v110.48,59.54 v110.48,63.98
  Bottom 0.305: v113.02,48.74 113.02,51.92 111.12,53.82 111.12,58.9 v110.48,59.54 | v110.48,63.98 112.39,65.89 116.83,65.89 118.74,67.79 IC13.1
DTR00  (via drill 0.6)
  Top 0.305: P2.26 153.03,62.71 147.95,62.71 147.31,63.35 R7.1 139.06,63.35 137.16,65.25 133.98,65.25 v133.34,65.89
  Bottom 0.305: v133.34,65.89 133.34,70.33 130.17,73.51 128.9,73.51 127.63,74.78 123.82,74.78 121.91,72.87 117.47,72.87 115.56,74.78 IC1.23
DWPROT  (via drill 0.6)
  Top 0.305: R5.1 148.59,59.54 149.22,60.17 153.03,60.17 P2.28 | IC2.16 41.27,50.65 43.18,48.74 47.62,48.74 48.26,49.38 52.07,49.38 55.24,52.55 72.38,52.55 73.66,51.28 81.27,51.28 81.91,51.92 93.34,51.92 94.29,52.87 96.2,52.87 97.78,51.28 104.13,51.28 v104.77,51.6 | v104.45,59.22 104.13,59.86 104.13,78.59 104.77,79.22 v104.77,79.86
  Bottom 0.305: v104.77,79.86 IC1.25 118.1,79.86 118.74,80.49 144.78,80.49 146.04,79.22 146.04,74.14 144.14,72.24 144.14,60.81 R5.1 | v104.45,59.22 104.45,57.63 104.77,57.32 v104.77,51.6
FASTCLK  (via drill 0.6)
  Top 0.305: v133.34,13.18 v133.34,36.68 133.34,43.66 133.98,44.3 133.98,49.38 v132.71,50.65 | RN3.6 144.78,36.68 146.04,37.95 146.04,41.76 147.95,43.66 X1.1 | v133.03,58.9 126.99,58.9 125.72,60.17 IC13.4
  Bottom 0.305: IC16.8 111.12,8.74 112.39,10.01 118.42,10.01 121.6,13.18 v133.34,13.18 | v133.34,36.68 RN3.6 | v132.71,50.65 132.71,55.09 133.34,55.73 133.34,58.27 133.03,58.58 v133.03,58.9
FSERCLK  (via drill 0.6)
  Top 0.305: IC2.40 50.8,88.75 53.97,91.92 53.97,93.83 54.61,94.46 106.67,94.46 107.94,92.56 v107.94,59.54 | v113.02,42.39 113.02,6.2 IC16.12 IC16.11
  Bottom 0.305: v107.94,59.54 110.48,56.36 110.48,50.01 112.39,48.11 112.39,43.03 v113.02,42.39
FSERDATA  (via drill 0.6)
  Top 0.305: IC2.39 55.24,91.29 55.24,93.83 105.41,93.83 106.67,91.92 106.67,83.03 107.31,82.4 107.31,77.95 106.67,77.32 v106.67,59.54 | v111.75,41.76 v111.75,18.9 | IC16.14 114.3,11.91 114.3,17.63 IC16.17
  Bottom 0.305: v106.67,59.54 109.85,55.73 109.85,49.38 111.75,47.47 v111.75,41.76 | v111.75,18.9 IC16.17
FSERDIR  (via drill 0.6)
  Top 0.305: IC2.15 41.27,53.19 43.18,55.09 48.26,55.09 48.89,54.46 51.43,54.46 52.7,53.19 73.02,53.19 74.29,51.92 80.64,51.92 81.27,52.55 92.7,52.55 93.66,53.51 96.83,53.51 98.1,52.23 v100.32,52.23 | v100.32,49.69 100.96,49.06 v100.96,45.57 | v104.77,42.39 104.77,26.52 IC16.1
  Bottom 0.305: v100.32,52.23 v100.32,49.69 | v100.96,45.57 100.96,42.39 v104.77,42.39 | IC16.19 114.3,23.98 111.75,26.52 IC16.1
GND  (via drill 0.6)
  Top 0.305: 18.41,30.96 JP1.1
  Top 0.508: C3.2 v95.24,57.63 | v123.19,83.03 123.19,76.68
  Top 0.61: IC8.7 20.95,43.66 20.95,39.85 19.68,38.58 IC8.9 IC8.10 18.41,35.41 JP1.1 v18.41,27.15 20.31,27.15 22.86,24.61 C17.1 | v93.34,90.02 IC18.10 | C16.1 v35.55,24.61 | v40,32.23 40,28.42 38.73,27.15 C16.1 | C16.1 40,25.88 v42.54,25.88 | v31.74,43.66 IC8.14 | IC11.7 80.64,3.02 83.18,5.56 83.18,8.74 85.08,10.64 IC11.11 IC11.12 IC11.13 85.08,15.72 82.55,18.26 82.55,18.9 80.64,20.8 C14.1 | IC9.7 54.61,29.69 53.34,28.42 53.34,25.88 C15.1 | IC1.14 v107.31,54.46 | 118.1,8.74 119.38,10.01 119.38,11.91 117.47,13.82 | 117.47,13.82 IC16.15 | v118.74,3.02 118.74,8.1 118.1,8.74 | 118.1,8.74 IC16.13 | IC16.2 109.21,23.98 110.48,25.25 110.48,27.15 v109.21,28.42 107.94,29.69 C19.1 107.94,42.39 108.58,43.03 JP7.3 | 117.47,13.82 118.1,14.45 v118.1,22.71 | C20.1 123.82,43.66 120.64,46.84 JP6.1 119.38,48.11 117.47,50.01 109.85,50.01 109.21,49.38 C6.2 | IC10.7 123.19,76.68 125.09,74.78 C2.2 | IC1.26 113.66,82.4 113.02,83.03 113.02,88.75 v116.2,91.92 120.64,96.37 C5.2 125.72,97.64 v151.76,97.64 | v45.72,25.88 45.72,23.34 46.98,22.07 v46.98,1.75 | IC7.10 73.66,62.08 74.92,63.35 74.92,81.76 76.19,83.03 76.19,88.11 C8.2 | C12.1 64.77,27.15 C7.2 67.94,5.56 QG1.7 | v105.41,61.44 105.41,78.59 106.04,79.22 v106.04,81.13 | v80,43.03 v80,28.42
  Bottom 0.305: R10.1 32.38,95.1 | P2.5 151.76,88.75 | IC16.4 107.94,18.9 | 145.41,47.47 P2.33
  Bottom 0.406: JP3.3 JP3.1
  Bottom 0.508: C13.1 24.12,58.9 25.39,57.63 27.93,57.63 31.11,54.46 31.11,51.92 32.38,50.65 32.38,44.3 v31.74,43.66 | C2.2 125.09,52.55 | 2.54,24.61 6.98,24.61 9.52,27.15 v18.41,27.15 | v107.31,54.46 107.31,57 105.72,58.9 105.41,59.86 v105.41,61.44
  Bottom 0.61: P1.C1 13.97,10.64 C1.- 15.87,8.1 20.95,3.02 IC3.8 24.12,3.02 25.39,1.75 32.38,1.75 33.65,3.02 IC4.8 39.37,3.02 40.64,1.75 v46.98,1.75 48.26,3.02 IC5.8 53.97,3.02 55.24,1.75 61.59,1.75 62.86,3.02 QG1.7 67.94,3.02 69.21,1.75 74.92,1.75 76.19,3.02 IC11.7 81.91,3.02 83.18,1.75 89.53,1.75 90.8,3.02 IC12.7 96.52,3.02 97.78,1.75 103.5,1.75 105.41,3.66 IC16.10 111.75,3.66 113.02,2.39 118.1,2.39 v118.74,3.02 | IC8.7 IC8.14 | P1.C32 14.6,89.38 17.77,92.56 | 17.77,92.56 20.95,95.73 R10.1 | 32.38,95.1 C9.2 IC2.1 42.54,88.75 44.45,90.65 53.34,90.65 55.24,88.75 C11.1 64.13,90.02 73.66,90.02 74.92,88.75 C8.2 77.46,88.75 78.73,90.02 v93.34,90.02 95.24,91.92 v116.2,91.92 | v35.55,24.61 30.47,24.61 29.2,25.88 26.03,25.88 C17.1 | JP8.3 38.1,34.14 v40,32.23 | v42.54,25.88 v45.72,25.88 49.53,25.88 51.43,23.98 C15.1 56.51,25.25 67.94,25.25 | P2.33 P2.31 P2.29 P2.27 P2.25 P2.23 P2.21 P2.19 P2.17 P2.15 P2.13 P2.11 P2.9 P2.7 P2.5 P2.3 P2.1 v151.76,97.64 | 84.45,25.25 85.08,24.61 85.08,22.71 85.72,22.07 96.52,22.07 C4.2 99.05,24.61 107.94,24.61 IC16.2 107.31,23.98 106.04,22.71 106.04,20.8 107.94,18.9 | 84.45,25.25 82.55,25.25 C14.1 | JP3.1 20.31,90.02 17.77,92.56 | IC17.10 60.96,62.08 62.23,63.35 67.3,63.35 67.94,62.08 | 67.94,62.08 IC7.10 74.29,62.08 75.56,60.81 81.91,60.81 82.55,60.17 C3.2 84.45,55.73 C21.1 | IC9.7 64.13,29.69 65.4,28.42 67.94,28.42 | 67.94,28.42 70.48,28.42 71.75,29.69 IC6.7 76.83,29.69 78.1,28.42 v80,28.42 84.45,28.42 | 84.45,28.42 85.08,28.42 86.35,29.69 IC15.7 90.16,28.42 v109.21,28.42 | 84.45,25.25 84.45,28.42 | C7.2 67.94,25.25 | 67.94,25.25 67.94,28.42
  Bottom 0.61: C12.1 64.77,58.27 67.94,62.08 | C21.1 85.72,48.74 86.99,47.47 92.07,47.47 93.34,48.74 C10.1 95.88,46.84 102.23,46.84 102.55,47.15 108.26,47.15 | 108.26,47.15 108.58,46.84 JP7.3 | 108.26,47.15 107.31,48.11 C6.2 v107.31,54.46 | v95.24,57.63 98.42,54.46 IC1.14 | IC18.10 96.52,81.76 97.15,81.13 v106.04,81.13 106.67,81.13 107.94,82.4 IC1.26 118.1,82.4 118.74,83.03 v123.19,83.03 | IC16.4 109.21,18.9 114.3,13.82 IC16.15 | v118.1,22.71 IC14.7 | X1.PE X1.PE@ 147.95,41.12 X1.2 145.41,47.47 143.5,49.38 130.81,49.38 129.53,48.11 129.53,45.57 130.17,44.93 130.17,43.03 128.9,41.76 127.63,41.76 C20.1 125.72,45.57 126.99,46.84 126.99,50.65 125.09,52.55 IC13.7 | C21.1 84.45,44.3 83.81,43.66 80.64,43.66 v80,43.03
  Bottom 0.813: 4.44,79.22 2.54,77.32 2.54,24.61 2.54,12.55 4.44,10.64 P1.A1
  Bottom 0.914: P1.A1 P1.C1 | P1.C32 P1.A32 P1.A31 P1.A30 P1.A29 P1.A28 4.44,79.22
  pour Bottom (isolate 0.61): 2.22,99.23 158.43,99.23 158.43,0.8 2.22,0.8
HIGHDENS  (via drill 0.6)
  Top 0.305: IC17.15 67.3,72.24 69.84,69.7 IC7.7 | v111.75,68.43 v111.75,60.17
  Bottom 0.305: IC7.7 74.29,69.7 75.56,68.43 81.27,68.43 83.18,70.33 95.88,70.33 97.78,68.43 v111.75,68.43 | v111.75,60.17 111.75,54.46 114.3,51.92 JP6.3
MTRA  (via drill 0.6)
  Top 0.305: IC2.4 36.19,81.13 43.81,88.75 43.81,94.46 44.45,95.1 107.31,95.1 v111.75,89.38 | v123.82,88.11 123.82,83.67 124.45,83.03 123.82,82.4 123.82,77.32 126.36,74.78 v126.36,73.51 | v126.36,65.25 127.63,63.98 132.07,63.98 v132.71,63.35
  Bottom 0.305: v111.75,89.38 116.2,89.38 117.47,88.11 v123.82,88.11 | v126.36,73.51 v126.36,65.25 | v132.71,63.35 132.07,62.71 132.07,60.81 131.44,60.17 IC13.11
MTRB  (via drill 0.6)
  Top 0.305: IC17.19 67.3,82.4 69.84,79.86 IC7.3 | v126.36,77.95 126.36,84.3 IC10.11
  Bottom 0.305: IC7.3 74.92,79.86 76.19,78.59 81.27,78.59 83.18,80.49 95.88,80.49 97.78,78.59 118.1,78.59 118.74,77.95 v126.36,77.95
N$1
  Top 0.305: IC3.15 30.47,18.26 31.74,19.53 31.74,25.25 33.02,26.52 JP9.6
N$2
  Top 0.305: IC3.10 30.47,5.56 33.02,8.1 33.02,23.98 JP9.2
N$3
  Top 0.305: JP9.7 JP9.5 JP9.3 JP9.1
  Bottom 0.305: JP9.1 40,29.69 40,20.8 39.37,20.17 39.37,13.18 IC4.4
N$4  (via drill 0.6)
  Top 0.305: IC9.1 61.59,44.93 62.86,43.66 v62.86,14.45
  Bottom 0.305: v62.86,14.45 55.24,14.45 53.97,13.18 IC5.4
N$5
  Top 0.305: IC3.12 30.47,10.64 32.38,12.55 32.38,24.61 35.55,27.79 JP9.4
N$6  (via drill 0.6)
  Top 0.305: v31.11,42.39 31.11,39.22 32.38,37.95 40,37.95 41.27,36.68 41.27,36.04 43.18,34.14 43.18,31.6 48.89,25.88 48.89,20.8 IC5.1 | v91.44,19.53 91.44,28.42 90.8,29.06 90.8,39.22 90.16,39.85 IC15.3
  Bottom 0.305: IC8.19 27.93,56.36 30.47,53.82 30.47,51.28 31.11,50.65 31.11,44.3 30.47,43.66 30.47,43.03 v31.11,42.39 | IC5.1 53.34,20.8 54.61,19.53 v91.44,19.53
N$7
  Bottom 0.305: IC17.5 61.59,74.78 62.86,76.05 67.3,76.05 68.57,74.78 IC7.5
N$8  (via drill 0.6)
  Top 0.305: IC5.5 53.34,10.64 55.24,12.55 v55.24,16.99
  Bottom 0.305: v55.24,16.99 56.51,18.26 IC5.15
N$9  (via drill 0.6)
  Top 0.305: P2.2 152.39,96.37 R11.1 | v123.19,72.24 119.38,76.05 119.38,90.02 120.01,90.65 123.19,90.65 125.72,93.19 127.63,93.19 v128.9,94.46
  Bottom 0.305: IC13.6 123.82,55.09 124.45,55.73 124.45,69.7 123.19,70.97 v123.19,72.24 | v128.9,94.46 131.76,94.46 132.39,93.83 134.62,93.83 135.25,94.46 142.87,94.46 R11.1
N$10  (via drill 0.6)
  Top 0.305: 96.52,85.57 96.52,63.98 v95.24,62.71 | v78.73,29.69 v78.73,46.2 | v78.1,59.54 80,59.54 81.91,61.44 IC18.19
  Top 0.406: IC1.1 98.42,87.48 96.52,85.57
  Bottom 0.305: v95.24,62.71 88.26,62.71 86.99,61.44 IC18.19 | IC9.6 62.86,32.23 64.13,30.96 77.46,30.96 v78.73,29.69 | v78.73,46.2 78.73,54.46 78.1,55.09 v78.1,59.54
N$11
  Top 0.305: IC8.5 20.95,48.74 22.22,47.47 22.22,35.41 20.95,34.14 JP1.2
N$12
  Top 0.305: IC9.8 68.57,29.69 69.84,30.96 69.84,41.12 73.66,44.93 IC6.1
N$13
  Bottom 0.305: RN3.4 140.33,31.6 142.23,33.5 142.23,37.95 X1.6 142.87,44.3 JP4.2
N$14  (via drill 0.6)
  Top 0.305: v85.72,33.5 85.72,36.04 86.99,37.31 IC15.4
  Bottom 0.305: IC9.10 69.84,34.77 71.11,33.5 v85.72,33.5
N$15
  Bottom 0.305: D1.A 137.16,47.47 JP4.1
N$16  (via drill 0.6)
  Top 0.305: R9.1 134.62,70.97 132.07,73.51 132.07,79.86 131.44,80.49 131.44,83.03 132.07,83.67 132.07,84.3 133.34,85.57 v133.34,88.11
  Bottom 0.305: v133.34,88.11 125.72,88.11 124.45,89.38 IC10.2
N$17  (via drill 0.6)
  Top 0.305: v133.98,83.03 133.98,74.78 134.62,74.14 RN1.8
  Bottom 0.305: IC10.4 123.82,84.3 125.09,83.03 v133.98,83.03
N$18  (via drill 0.6)
  Top 0.305: IC12.1 93.34,16.36 92.7,15.72 92.07,15.72 90.8,14.45 90.8,12.55 92.7,10.64 IC12.4 | v103.5,16.99 103.5,32.23 101.59,34.14 v101.59,41.12 | v118.1,58.9 119.38,58.9 120.64,57.63 IC13.5
  Bottom 0.305: v103.5,16.99 97.15,16.99 95.88,18.26 IC12.1 IC12.2 | v101.59,41.12 102.55,40.49 112.39,40.49 114.3,38.58 116.2,38.58 116.83,39.22 JP6.2 116.83,56.36 118.1,57.63 v118.1,58.9
N$19  (via drill 0.6)
  Top 0.305: v139.06,77.95 v139.06,81.76
  Bottom 0.305: IC10.8 132.07,76.68 133.34,77.95 v139.06,77.95 | v139.06,81.76 RN1.5
N$20
  Bottom 0.305: IC10.6 126.36,79.22 127.63,77.95 132.07,77.95 133.34,79.22 RN1.6
N$21
  Top 0.305: IC2.19 40,43.03 43.81,39.22 R3.2 45.72,36.04 48.26,33.5 JP5.2
N$22
  Top 0.305: JP2.1 87.62,25.25 86.35,26.52 86.35,31.6 86.99,32.23 IC15.6
N$23
  Bottom 0.305: IC10.12 129.53,86.84 132.07,84.3 RN1.4
N$24  (via drill 0.6)
  Top 0.305: IC13.2 123.82,65.25 125.09,66.52 125.72,66.52 128.9,69.7 130.81,69.7 131.44,70.33 131.44,79.54 130.81,80.17 130.81,83.35 131.44,83.98 131.44,86.21 v132.07,86.84
  Bottom 0.305: v132.07,86.84 RN1.3
N$25
  Top 0.305: P2.32 154.94,56.36 155.57,57 155.57,90.02 154.94,90.65 148.59,90.65 147.31,91.92 RN1.16
N$26  (via drill 0.6)
  Top 0.305: v96.52,4.29 96.52,20.17 JP2.3
  Bottom 0.305: QG1.8 74.29,3.02 75.56,4.29 v96.52,4.29
N$27
  Top 0.305: IC11.10 87.62,8.1 88.89,9.37 | 88.89,9.37 88.89,20.17 90.16,21.44 JP2.2 | IC12.5 90.16,8.1 88.89,9.37
N$28
  Bottom 0.305: IC11.9 89.53,5.56 90.8,6.83 96.52,6.83 97.78,8.1 IC12.10
N$29
  Bottom 0.305: IC12.6 96.52,5.56 97.78,6.83 102.86,6.83 103.5,7.47 103.5,12.55 102.86,13.18 IC12.12
N$30
  Top 0.305: IC12.8 102.23,3.02 104.13,4.93 104.13,13.82 102.23,15.72 IC12.13
N$31  (via drill 0.6)
  Top 0.305: v98.42,10.64 98.42,6.2 99.05,5.56 IC12.9
  Bottom 0.305: IC12.3 95.88,13.18 v98.42,10.64
N$32  (via drill 0.6)
  Top 0.305: IC13.8 131.44,52.55 133.98,53.82 v142.23,53.82 | v147,87.79 146.68,88.11 141.6,88.11 137.79,91.92 RN1.1
  Bottom 0.305: v142.23,53.82 146.04,53.82 147.31,55.09 147.31,67.16 147.95,67.79 147.95,74.14 148.59,74.78 148.59,79.22 146.68,81.13 146.68,87.16 147,87.48 v147,87.79
N$33
  Bottom 0.305: IC18.9 95.88,79.22 97.78,77.32 IC1.5
N$34
  Bottom 0.305: IC18.8 95.88,76.68 97.78,74.78 IC1.6
N$35
  Bottom 0.305: IC18.7 95.88,74.14 97.78,72.24 IC1.7
N$36
  Bottom 0.305: IC18.6 95.88,71.6 97.78,69.7 IC1.8
N$37
  Bottom 0.305: IC18.5 95.88,69.06 97.78,67.16 IC1.9
N$38
  Bottom 0.305: IC18.4 95.88,66.52 97.78,64.62 IC1.10
N$39  (via drill 0.6)
  Top 0.305: IC12.11 100.32,10.64 99.05,11.91 99.05,43.03 98.42,43.66 v98.42,49.06
  Bottom 0.305: v98.42,49.06 99.05,48.74 101.59,48.74 104.13,52.55 104.13,56.68 103.5,57.32 103.5,62.08 104.13,62.71 107.31,62.71 107.94,62.08 IC1.18
N$40
  Bottom 0.305: IC18.3 95.88,63.98 97.78,62.08 IC1.11
N$41
  Bottom 0.305: IC18.2 95.88,61.44 97.78,59.54 IC1.12
N$42  (via drill 0.6)
  Top 0.305: P2.4 153.03,93.19 v150.49,93.19
  Bottom 0.305: v150.49,93.19 120.64,93.19 117.47,96.37 JP10.2
N$43
  Top 0.305: RN1.15 147.31,89.38 151.12,85.57 153.03,85.57 P2.10
N$44  (via drill 0.6)
  Top 0.305: v121.28,18.26 120.64,18.9 120.64,30.33 IC14.4
  Bottom 0.305: R1.1 v121.28,18.26
N$45
  Bottom 0.305: R1.2 151.12,18.9 LED1.K
N$46
  Top 0.305: R2.2 153.03,14.45 154.3,15.72 154.94,15.72 155.57,16.36 LED2.K
N$47  (via drill 0.6)
  Top 0.305: v121.28,14.45 121.28,15.09 120.01,16.36 120.01,35.41 IC14.2
  Bottom 0.305: R2.1 v121.28,14.45
N$48
  Top 0.305: RN1.14 146.04,86.84 149.85,83.03 153.03,83.03 P2.12
N$49
  Top 0.305: IC2.24 52.07,48.11 55.24,51.28 66.03,51.28 67.3,50.01 78.1,50.01 81.27,46.84 83.18,46.84
  Top 0.406: 83.18,46.84 87.62,42.39 IC15.2
N$50
  Top 0.305: RN1.13 147.31,84.3 151.12,80.49 153.03,80.49 P2.14
N$51
  Bottom 0.305: IC6.6 77.46,32.23 78.73,30.96 105.41,30.96 106.67,29.69 110.48,29.69 111.75,28.42 118.74,28.42 119.38,27.79 IC14.5
N$52  (via drill 0.6)
  Top 0.305: P2.22 153.03,67.79 v149.22,67.79 | v147.95,81.76 RN1.12
  Bottom 0.305: v149.22,67.79 149.22,80.49 v147.95,81.76
N$53  (via drill 0.6)
  Top 0.305: P2.24 153.03,65.25 v141.6,65.25
  Bottom 0.305: v141.6,65.25 141.6,79.22 RN1.11
N$55
  Top 0.305: RN1.9 147.31,74.14 148.59,72.87 153.03,72.87 P2.18
N$56
  Top 0.305: R9.2 148.59,70.97 149.22,70.33 153.03,70.33 P2.20
N$57
  Bottom 0.305: JP8.2 35.55,35.41 36.83,34.14 IC4.1
N$58  (via drill 0.6)
  Top 0.305: v134.62,13.18 v134.62,39.22 134.62,50.01 v133.98,50.65 | v133.98,61.44 126.99,61.44 125.72,62.71 IC13.3
  Bottom 0.305: IC16.9 111.12,6.2 112.39,7.47 118.74,7.47 118.74,8.42 122.55,12.23 134.3,12.23 v134.62,13.18 | v134.62,39.22 RN3.7 | v133.98,50.65 v133.98,61.44
N$59  (via drill 0.6)
  Top 0.305: v136.52,20.17 136.52,41.76 | 136.52,41.76 RN3.8 | 136.52,41.76 135.88,42.39 135.88,49.38 137.79,51.28 v139.69,51.28 | v139.69,65.89 134.62,65.89 133.34,67.16 132.07,67.16 IC13.13
  Bottom 0.305: IC16.3 111.75,21.44 113.02,20.17 v136.52,20.17 | v139.69,51.28 v139.69,65.89
N$60  (via drill 0.6)
  Top 0.305: v103.5,36.04 JP7.1
  Bottom 0.305: IC9.11 69.21,37.31 70.48,36.04 v103.5,36.04
N$61  (via drill 0.6)
  Top 0.305: P2.16 153.03,75.41 148.59,75.41 147.31,76.68 RN1.10 141.6,76.68 140.97,77.32 v140.97,86.84
  Bottom 0.305: v140.97,86.84 137.16,90.65 119.38,90.65 116.2,93.83 JP10.1
PHI2  (via drill 0.6)
  Top 0.305: P1.C26 26.03,74.14 v29.84,70.33 | JP5.3 53.34,34.77 v55.24,34.77 IC9.5 61.59,34.77 61.59,27.79 60.32,26.52 60.32,13.82 59.69,13.18 IC5.13
  Bottom 0.305: v29.84,70.33 33.02,67.16 33.02,56.36 33.65,55.73 33.65,54.46 38.73,54.46 41.91,51.28 47.62,51.28 48.26,50.65 IC2.25 55.24,50.65 v55.24,34.77
PWRLED  (via drill 0.6)
  Top 0.305: IC2.7 36.83,73.51 38.1,74.78 52.07,74.78 53.34,73.51 59.05,73.51 61.59,70.97 66.67,70.97 67.94,69.7 v67.94,60.17 | v67.94,51.28 72.38,51.28 73.02,50.65 81.91,50.65 82.55,51.28 93.97,51.28 94.93,52.23 95.56,52.23 97.15,50.65 107.31,50.65 107.94,51.28 v115.56,51.28 | v115.56,39.85 117.47,37.95 IC14.1
  Bottom 0.305: v67.94,60.17 v67.94,51.28 | v115.56,51.28 v115.56,39.85
R/-W  (via drill 0.6)
  Top 0.305: P1.C25 26.03,71.6 v28.57,69.06 | v58.41,60.17 58.41,59.54 59.69,58.27 69.84,58.27 71.11,59.54 74.29,59.54 75.56,58.27 78.73,58.27 79.37,58.9 80.64,58.9 81.91,60.17 86.99,60.17 88.26,58.9 IC18.1 95.24,58.9 97.15,60.81 97.15,84.3 | v57.78,46.84 48.89,46.84 47.62,48.11 v40.64,48.11 | v56.51,27.15 56.51,15.72 IC5.14
  Top 0.406: IC1.2 97.78,84.94 97.15,84.3
  Bottom 0.305: v28.57,69.06 32.38,65.25 32.38,55.73 33.02,55.09 33.02,53.19 34.29,51.92 36.83,51.92 39.68,49.06 | v40.64,48.11 45.72,43.03 IC2.22 52.07,43.03 53.97,41.12 53.97,29.69 v56.51,27.15 | v58.41,60.17 57.78,59.54 v57.78,46.84
  Bottom 0.406: v40.64,48.11 39.68,49.06
SELA  (via drill 0.6)
  Top 0.305: IC9.12 IC9.13 68.57,42.39 69.84,43.66 v69.84,46.2 | v69.84,60.17 69.84,67.79 70.48,68.43 73.66,68.43 73.66,72.24 IC7.6
  Bottom 0.305: IC17.6 61.59,72.24 62.86,73.51 67.3,73.51 68.57,72.24 IC7.6 | v69.84,46.2 v69.84,60.17
SELB  (via drill 0.6)
  Top 0.305: v126.36,85.57 126.36,88.11 127.63,89.38 IC10.13
  Bottom 0.305: IC17.2 60.96,82.4 62.23,83.67 67.94,83.67 69.21,82.4 IC7.2 75.56,82.4 76.83,81.13 81.27,81.13 83.18,83.03 93.34,83.03 93.97,83.67 117.47,83.67 119.38,85.57 v126.36,85.57
SIDE0  (via drill 0.6)
  Top 0.305: IC2.2 37.46,86.21 41.27,90.02 41.27,97 43.81,97 45.08,95.73 107.31,95.73 v108.58,97 | v133.34,73.51 133.98,73.51 134.62,72.87 139.06,72.87 v140.33,74.14 | v140.33,76.68 140.33,84.3 139.06,85.57 139.06,88.75 137.16,90.65 133.98,90.65 132.71,91.92 132.71,94.46 v133.34,95.1
  Bottom 0.305: IC13.9 131.44,55.09 132.71,56.36 132.71,57.63 132.07,58.27 132.07,59.54 132.71,60.17 132.71,62.08 133.98,63.35 133.98,64.62 134.62,65.25 134.62,65.89 133.98,66.52 133.98,72.87 v133.34,73.51 | v140.33,74.14 v140.33,76.68 | v133.34,95.1 130.81,97.64 109.21,97.64 v108.58,97
SLOWCLK  (via drill 0.6)
  Top 0.305: v114.3,33.5 v114.3,29.69
  Bottom 0.305: IC15.11 110.48,37.31 v114.3,33.5 | v114.3,29.69 119.38,29.69 120.01,29.06 126.36,29.06 127.63,27.79 IC14.10 132.71,27.79 133.98,26.52 RN3.2 142.87,26.52 144.78,28.42 144.78,32.87 X1.4
STEP  (via drill 0.6)
  Top 0.305: v118.1,60.81 118.1,84.94 118.74,85.57 118.74,90.65 120.01,91.92 IC10.1
  Bottom 0.305: IC1.16 115.56,57 116.83,58.27 116.83,59.54 v118.1,60.81
UNIT0
  Top 0.406: IC2.6 34.29,76.05 24.76,85.57 24.76,91.29 JP3.2
UNIT1
  Top 0.406: IC2.5 34.29,78.59 27.3,85.57 27.3,91.29 JP3.4
VCC  (via drill 0.6)
  Top 0.305: IC8.3 IC8.18
  Top 0.406: 45.72,44.3 v53.97,44.3
  Top 0.508: 8.89,44.93 v14.6,44.93 | v24.12,44.93 29.2,44.93 33.65,49.38 v41.27,49.38 | C2.1 127.63,74.78 125.09,77.32 125.09,90.02 | 8.25,19.53 3.17,19.53 2.54,20.17
  Top 0.61: 27.3,27.15 23.49,30.96 JP1.3 23.49,37.31 24.76,38.58 | 27.3,27.15 C17.2 27.93,24.61 29.84,22.71 IC3.16 28.57,20.8 27.3,19.53 27.3,10.01 25.08,7.79 22.54,7.79 IC3.6 | JP9.8 29.2,29.06 27.3,27.15 | IC8.12 24.76,38.58 | 24.76,38.58 24.12,39.22 v24.12,44.93 24.12,48.11 24.76,48.74 IC8.16 | IC17.20 C11.2 v65.4,91.29 | C8.1 IC7.20 88.89,84.94 v88.89,60.81 | IC8.18 29.2,53.82 v30.47,57 | C16.2 40,23.34 v34.92,23.34 | IC12.14 100.96,22.71 C4.1 v100.32,34.14 100.32,44.3 v99.69,44.93 | IC11.14 86.35,20.17 C14.2 83.18,27.15 84.45,28.42 84.45,37.31 83.81,37.95 83.81,43.03 IC6.14 | QG1.14 73.02,21.44 C7.1 | v55.24,27.15 55.24,27.79 55.88,28.42 57.15,28.42 57.78,27.79 C15.2 | C3.1 80.64,57.63 81.91,58.9 IC18.20 | C21.2 83.18,50.01 v86.99,50.01 | C10.2 IC15.14 | C19.2 v110.48,34.14 | v128.27,50.65 130.81,50.65 132.07,51.92 R8.2 | IC13.14 130.81,67.79 131.44,68.43 133.98,68.43 R6.2 | RN3.1 152.39,23.98 LED1.A 156.84,19.53 156.84,14.45 LED2.A | IC16.20 v116.2,30.96 v116.2,36.68 | C20.2 128.27,42.39 130.17,40.49 IC14.14 | 131.12,94.14 IC10.14 126.99,91.92 125.09,90.02 | 131.12,94.14 132.71,96.37 R11.2 | 131.12,94.14 128.9,96.37 C5.1 125.09,94.46 121.28,94.46 117.47,90.65 v116.83,90.65 | P1.C3 10.16,15.72 | 8.25,19.53 8.25,44.3 8.89,44.93 | v45.72,92.56 v45.72,85.57 | v45.72,50.01 v45.72,53.19 | v45.72,40.49 45.72,44.3 v45.72,46.84 | 2.54,20.17 2.54,89.38 4.44,91.29 17.77,91.29 21.58,95.1 27.93,95.1 29.2,93.83 36.19,93.83 C9.1 | R4.2 133.98,55.73 132.07,53.82 127.63,53.82 126.99,54.46 125.09,54.46 124.45,53.82 119.38,53.82 118.74,54.46 IC1.15 111.75,54.46 110.48,55.73 v106.04,55.73 v102.23,55.73
  Top 0.61: v53.97,48.74 62.23,48.74 63.5,50.01 66.03,50.01 C12.2
  Top 0.914: 10.16,15.72 8.25,17.63 8.25,19.53
  Bottom 0.305: IC8.2 IC8.3 | IC8.16 27.3,48.74 | 27.93,53.82 IC8.18 | 111.12,30.96 110.48,31.6 C19.2 | IC14.14 129.53,37.95
  Bottom 0.61: IC3.6 24.76,8.1 26.03,6.83 32.38,6.83 33.65,8.1 IC4.6 | IC8.12 29.84,38.58 31.74,40.49 IC2.20 v45.72,40.49 46.98,40.49 R3.1 51.43,35.41 52.7,34.14 52.7,29.69 v55.24,27.15 | C13.2 IC8.20 27.93,58.9 v30.47,57 | 27.3,48.74 28.57,50.01 28.57,53.19 27.93,53.82 | IC17.20 IC7.1 IC7.20 | C9.1 v45.72,92.56 53.97,92.56 55.24,91.29 v65.4,91.29 | v34.92,23.34 28.57,23.34 C17.2 | C16.2 42.54,24.61 44.45,22.71 | 44.45,22.71 IC4.16 | 44.45,22.71 57.15,22.71 57.78,23.34 C15.2 58.41,23.34 | IC5.16 58.41,23.34 | C4.1 97.78,20.8 85.72,20.8 C14.2 81.27,21.44 76.19,21.44 73.66,23.98 C7.1 69.21,22.71 59.05,22.71 58.41,23.34 | C12.2 IC9.14 69.84,44.93 71.11,43.66 75.56,43.66 76.19,43.03 78.42,43.03 80.32,44.93 IC6.14 C21.2 81.91,54.46 80,56.36 C3.1 | v86.99,50.01 87.62,50.01 88.89,48.74 92.07,48.74 93.34,50.01 95.24,50.01 C10.2 97.47,47.79 101.91,47.79 103.5,49.38 C6.1 106.04,50.65 v106.04,55.73 | IC18.20 88.26,58.9 88.89,59.54 v88.89,60.81 89.53,61.44 90.8,61.44 92.07,60.17 95.24,60.17 96.52,58.9 96.52,57.63 98.42,55.73 v102.23,55.73 | v110.48,34.14 v100.32,34.14 | IC15.14 v99.69,44.93 | C20.2 v128.27,50.65 | R8.2 R4.2 R5.2 R7.2 135.88,63.98 135.88,66.52 R6.2 | RN3.1 128.27,23.98 125.72,26.52 IC16.20 | v116.2,30.96 111.12,30.96 | 129.53,37.95 128.27,36.68 v116.2,36.68 | IC13.14 130.17,69.7 C2.1 | C8.1 93.97,88.75 95.88,90.65 v116.83,90.65 | v14.6,44.93 v24.12,44.93 | v45.72,85.57 v45.72,53.19 | v41.27,49.38 41.91,49.38 42.54,50.01 v45.72,50.01 v45.72,46.84 | v53.97,44.3 v53.97,48.74
  Bottom 0.914: P1.C3 P1.C2 13.97,13.18 C1.+ 19.04,8.1 IC3.6
WD_DRQ  (via drill 0.6)
  Top 0.305: v110.48,65.89 v110.48,84.94
  Bottom 0.305: IC7.8 74.29,67.16 75.56,65.89 81.27,65.89 83.18,67.79 95.88,67.79 97.78,65.89 v110.48,65.89 | v110.48,84.94 IC1.27
WD_INTR  (via drill 0.6)
  Top 0.305: v109.21,63.35 v109.21,87.48
  Bottom 0.305: IC7.9 74.29,64.62 75.56,63.35 81.27,63.35 83.18,65.25 95.88,65.25 97.78,63.35 v109.21,63.35 | v109.21,87.48 IC1.28
WDCSEL
  Top 0.305: IC9.3 IC9.4
WRDATA  (via drill 0.6)
  Top 0.305: v121.91,70.97 130.17,70.97 130.81,71.6 130.81,79.22 IC10.9
  Bottom 0.305: IC1.22 120.64,72.24 v121.91,70.97
WRGATE  (via drill 0.6)
  Top 0.305: v112.39,81.13 112.39,69.7 IC1.21
  Bottom 0.305: IC10.5 118.74,81.76 118.1,81.13 v112.39,81.13

## Text on the board
Top: CSA-DRVIO-V1.1A | (C) A. Fachat
tNames: CSA-DRVIO-V1.1A | (C) A. Fachat